# EAGLE design FlowSensor (EAGLE 9.3.1)
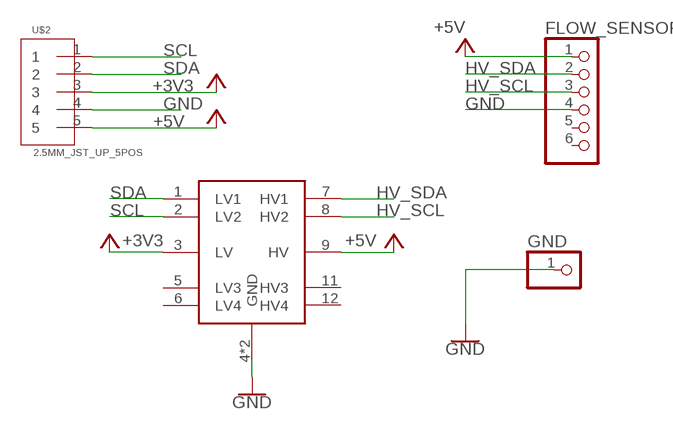
[diagram p0: schematic, sheet 1]

## Parts
FLOW_SENSOR  PINHD-1X6  [1X06]
GND  PINHD-1X1  [1X01]
U$1  LOGIC_LEVEL_CONVERTER  [LOGIC_LEVEL_CONVERTER]
U$2  2.5MM_JST_UP_5POS  [JST_5POS_2.5MM_UP]

## Nets
+3V3: U$1.3(LV) U$2.3
+5V: FLOW_SENSOR.1 U$1.9(HV) U$2.5
GND: FLOW_SENSOR.4 GND.1 U$1.4(GND) U$1.10(GND) U$2.4
HV_SCL: FLOW_SENSOR.3 U$1.8(HV2)
HV_SDA: FLOW_SENSOR.2 U$1.7(HV1)
SCL: U$1.2(LV2) U$2.1
SDA: U$1.1(LV1) U$2.2
Unconnected: FLOW_SENSOR.5 FLOW_SENSOR.6 U$1.5(LV3) U$1.6(LV4) U$1.11(HV3) U$1.12(HV4)

## Library data of the parts
FLOW_SENSOR = adafruit:PINHD-1X6: PIN HEADER
GND = adafruit:PINHD-1X1: Pin header 1x1 for 0.1" spacing With round pins
U$1 = eDNA:LOGIC_LEVEL_CONVERTER
U$2 = eDNA:2.5MM_JST_UP_5POS: 2.5MM JST 5POS, 5 Position, up https://www.digikey.com/product-detail/en/jst-sales-america-inc/B5B-XH-A-LF-SN/455-2270-ND/1530483

## Board
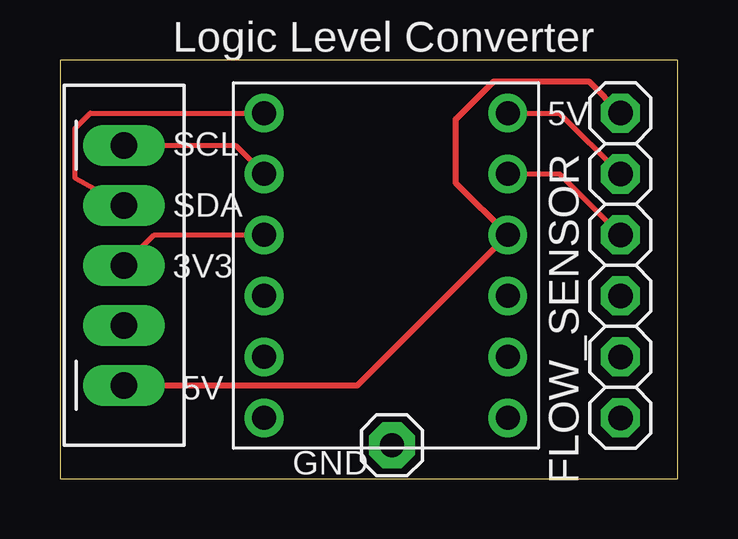
[diagram p1: board, top side]
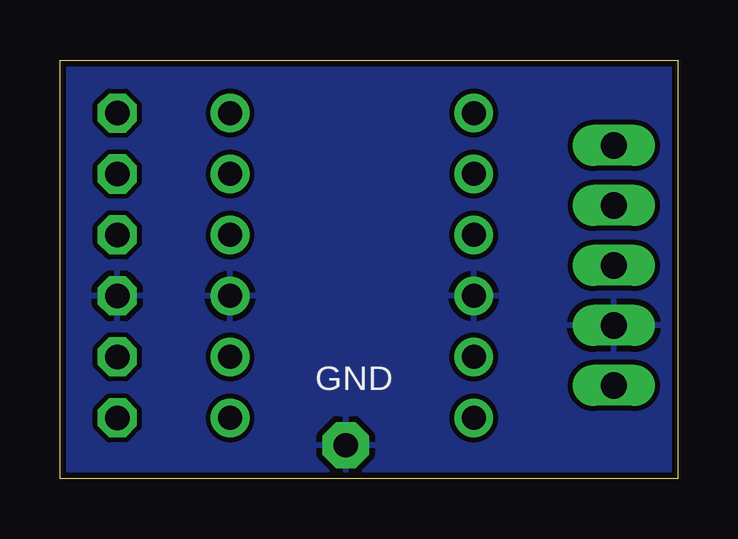
[diagram p2: board, bottom side, seen from below]

Size 25.76 x 17.45 mm. Coordinates in mm from the lower left corner, seen from the top.
Outline: 0,0 25.76,0 25.76,17.45 0,17.45 0,0
Copper layers (1*16): Top 0.035mm / dielectric 1.5mm / Bottom 0.035mm
Design rules "SparkFun": minimum track width 8mil, minimum drill 20mil, track to track 8mil, track to pad 8mil, pad to pad 8mil, via to via 8mil, smd to smd 8mil, copper to edge 10mil, drill to drill 8mil, minimum pad ring 12mil, minimum via ring 10mil, stop-mask expansion 4mil, vias tented up to drill 25mil, thermal gap 10mil

### Footprints (pad centres in the part's own frame; a part is rotated, then mirrored left to right if it is on the bottom)
1X06 = drill 1.016 octagon: 1 -6.35,0; 2 -3.81,0; 3 -1.27,0; 4 1.27,0; 5 3.81,0; 6 6.35,0
1X01 = drill 1.016 pad 1.93 octagon: 1 0,0
LOGIC_LEVEL_CONVERTER = drill 1: 1 -5.08,6.35; 2 -5.08,3.81; 3 -5.08,1.27; 4 -5.08,-1.27; 5 -5.08,-3.81; 6 -5.08,-6.35; 7 5.08,6.35; 8 5.08,3.81; 9 5.08,1.27; 10 5.08,-1.27; 11 5.08,-3.81; 12 5.08,-6.35
JST_5POS_2.5MM_UP = drill 1.1 long: 1 -5,0; 2 -2.5,0; 3 0,0; 4 2.5,0; 5 5,0

### Placement (x,y rotation side)
FLOW_SENSOR  23.37,8.89 270 top
GND  13.84,1.4 0 top
U$1  13.59,8.89 0 top
U$2  2.67,8.89 270 top

### Tracks (layer width: path | path; a pad name or v marks a point on that pad's centre or on a via)
+3V3
  Top 0.203: U$2.3 3.94,10.16 U$1.3
+5V
  Top 0.254: U$2.5 12.4,3.89 U$1.9 16.51,12.32 16.51,14.99 18.09,16.56 22.05,16.56 FLOW_SENSOR.1
GND
  pour Bottom: 0,17.78 27.94,17.78 27.94,0 0,0
HV_SCL
  Top 0.203: U$1.8 20.83,12.7 FLOW_SENSOR.3
HV_SDA
  Top 0.203: U$1.7 20.83,15.24 FLOW_SENSOR.2
SCL
  Top 0.203: U$2.1 7.32,13.89 U$1.2
SDA
  Top 0.203: U$2.2 0.64,12.53 0.64,14.61 1.27,15.24 U$1.1

### Text on the board
tPlace: 5V | SCL | SDA | 3V3 | 5V
bPlace: GND